# EAGLE design PowerInModule (EAGLE 6.5.0)
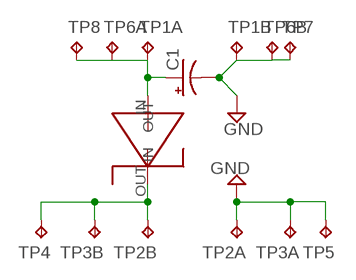
[diagram p0: schematic, sheet 1]

## Parts
C1  CPOL-USE2.5-6  [E2,5-6]
TP1  TP2P2-38-20  [P2-38-20]
TP2  TP2P2-38-20  [P2-38-20]
TP3  TP2P2-38-20  [P2-38-20]
TP4  TPPAD1-20  [P1-20]
TP5  TPPAD1-20  [P1-20]
TP6  TP2P2-38-20  [P2-38-20]
TP7  TPPAD1-20  [P1-20]
TP8  TPPAD1-20  [P1-20]
U$1  DO-214AB  [DO-214AB]

## Nets
GND: C1.- TP1.TP-2 TP2.TP-1 TP3.TP-1 TP5.TP TP6.TP-2 TP7.TP
N$1: C1.+ TP1.TP-1 TP6.TP-1 TP8.TP U$1.IN
N$3: TP2.TP-2 TP3.TP-2 TP4.TP U$1.OUT

## Library data of the parts
C1 = resistor:CPOL-US: POLARIZED CAPACITOR, American symbol
TP1-TP3 TP6 = testpad:TP2: Test pad
TP4 TP5 TP7 TP8 = testpad:TP: Test pad
U$1 = Diodes:DO-214AB

## Board
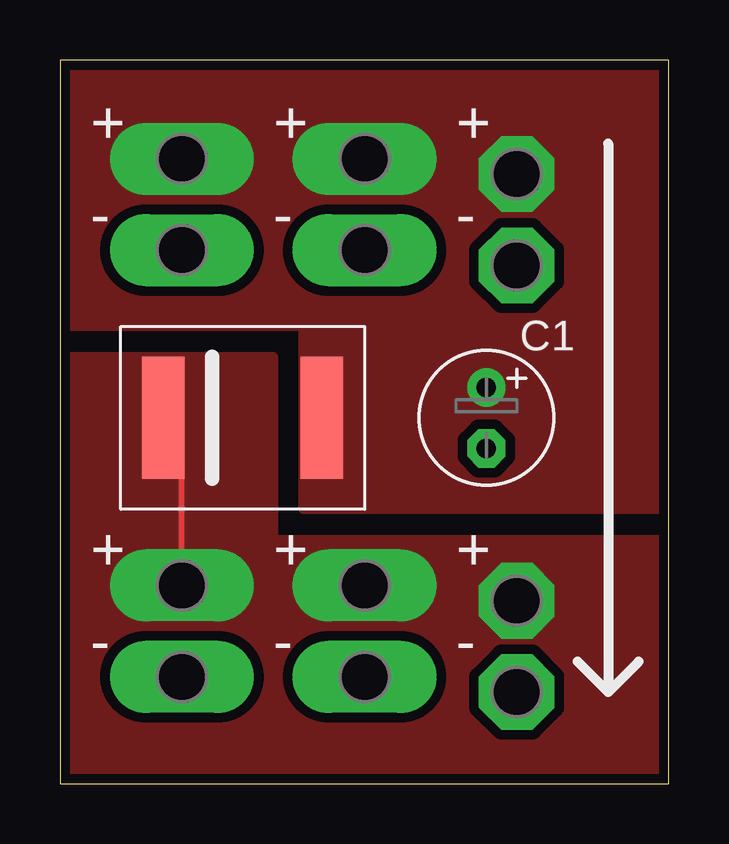
[diagram p1: board, top side]
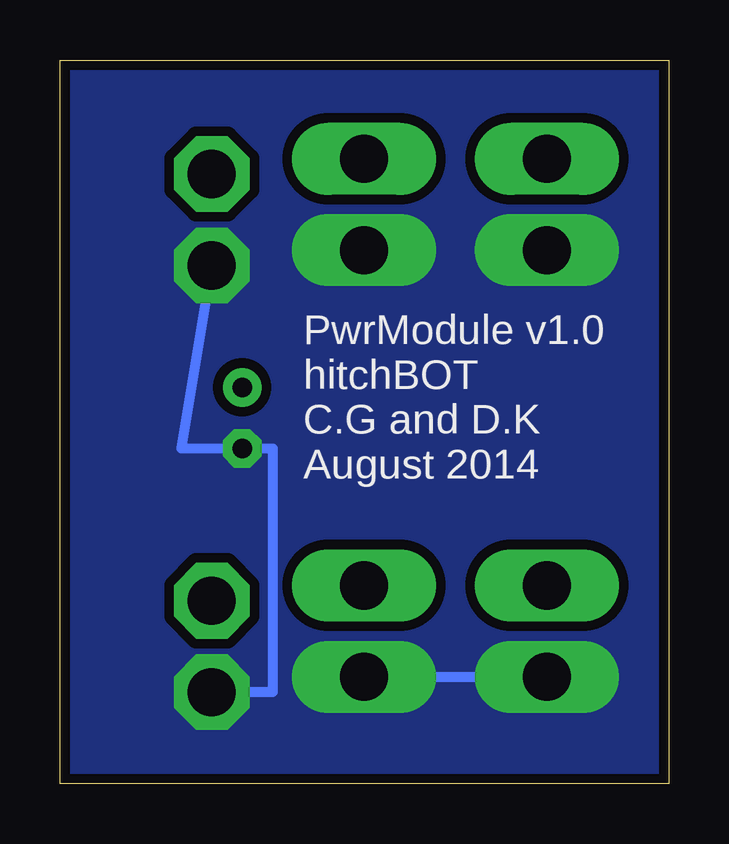
[diagram p2: board, bottom side, seen from below]

Size 25.38 x 30.15 mm. Coordinates in mm from the lower left corner, seen from the top.
Outline: 0,0 25.38,0 25.38,30.15 0,30.15 0,0
Copper layers (1*16): Top 0.0356mm / dielectric 1.5011mm / Bottom 0.0356mm
Design rules "LaenPCBOrder": minimum track width 6mil, minimum drill 13mil, track to track 6mil, track to pad 6mil, pad to pad 6mil, via to via 6mil, smd to smd 6mil, copper to edge 15mil, drill to drill 6mil, minimum pad ring 7mil, minimum via ring 7mil, stop-mask expansion 3mil, vias tented up to drill 0mil, thermal gap 10mil

### Footprints (pad centres in the part's own frame; a part is rotated, then mirrored left to right if it is on the bottom)
E2,5-6 = drill 0.813 pad 1.6: + -1.27,0 | drill 0.813 pad 1.6 octagon: - 1.27,0
P2-38-20 = drill 2.007 pad 2.54 long: TP-1 -1.905,0; TP-2 1.905,0
P1-20 = drill 2.007 pad 3.15 octagon: TP 0,0
DO-214AB = smd 1.778 x 5.08: IN -3.302,0; OUT 3.302,0

### Placement (x,y rotation side)
C1  17.78,15.24 270 top
TP1  5.08,24.13 270 top
TP2  12.7,6.35 90 top
TP3  5.08,6.35 90 top
TP4  19.05,7.62 0 top
TP5  19.05,3.81 0 top
TP6  12.7,24.13 270 top
TP7  19.05,21.59 0 top
TP8  19.05,25.4 0 top
U$1  7.62,15.24 180 top

### Tracks (layer width: path | path; a pad name or v marks a point on that pad's centre or on a via)
GND
  Bottom 0.406: TP7.TP 20.32,13.97 C1.- 16.51,13.97 16.51,3.81 TP5.TP | 12.7,3.81 TP2.TP-1 TP3.TP-1
  pour Bottom (isolate 0.406, no thermals): -1.27,30.48 26.67,30.48 26.67,-1.27 -1.27,-1.27
  pour Bottom (isolate 0.61): -1.27,30.48 24.13,30.48 24.13,-1.27 -1.27,-1.27
  pour Bottom (isolate 0.61): -1.27,30.48 27.94,30.48 27.94,-1.27 -1.27,-1.27
N$1
  Top 0.254: 11.43,15.24 11.43,16.51 U$1.IN 11.43,15.24
  pour Top (isolate 0.406, no thermals): -1.27,30.48 25.4,30.48 25.4,11.43 10.16,11.43 10.16,19.05 -1.27,19.05
N$3
  Top 0.254: TP3.TP-2 5.08,15.24 U$1.OUT | 12.7,8.89 TP2.TP-2
  Top 0.406: 19.05,8.26 TP4.TP
  pour Top (isolate 0.406, no thermals): -1.27,17.78 8.89,17.78 8.89,10.16 25.4,10.16 25.4,-1.27 -1.27,-1.27

### Text on the board
tPlace: + | + | + | - | - | - | + | + | + | - | - | -
bPlace: PwrModule v1.0 / hitchBOT / C.G and D.K / August 2014